# Altium schematic sheet [10]-EMMC Chip.SchDoc: RK3399 SOM Board Design V1.0
size A4; Author: AVIRAL MISHRA; DocumentNumber: 11; SheetNumber: 11; SheetTotal: 12; PROJECT CODE: A_V1.0
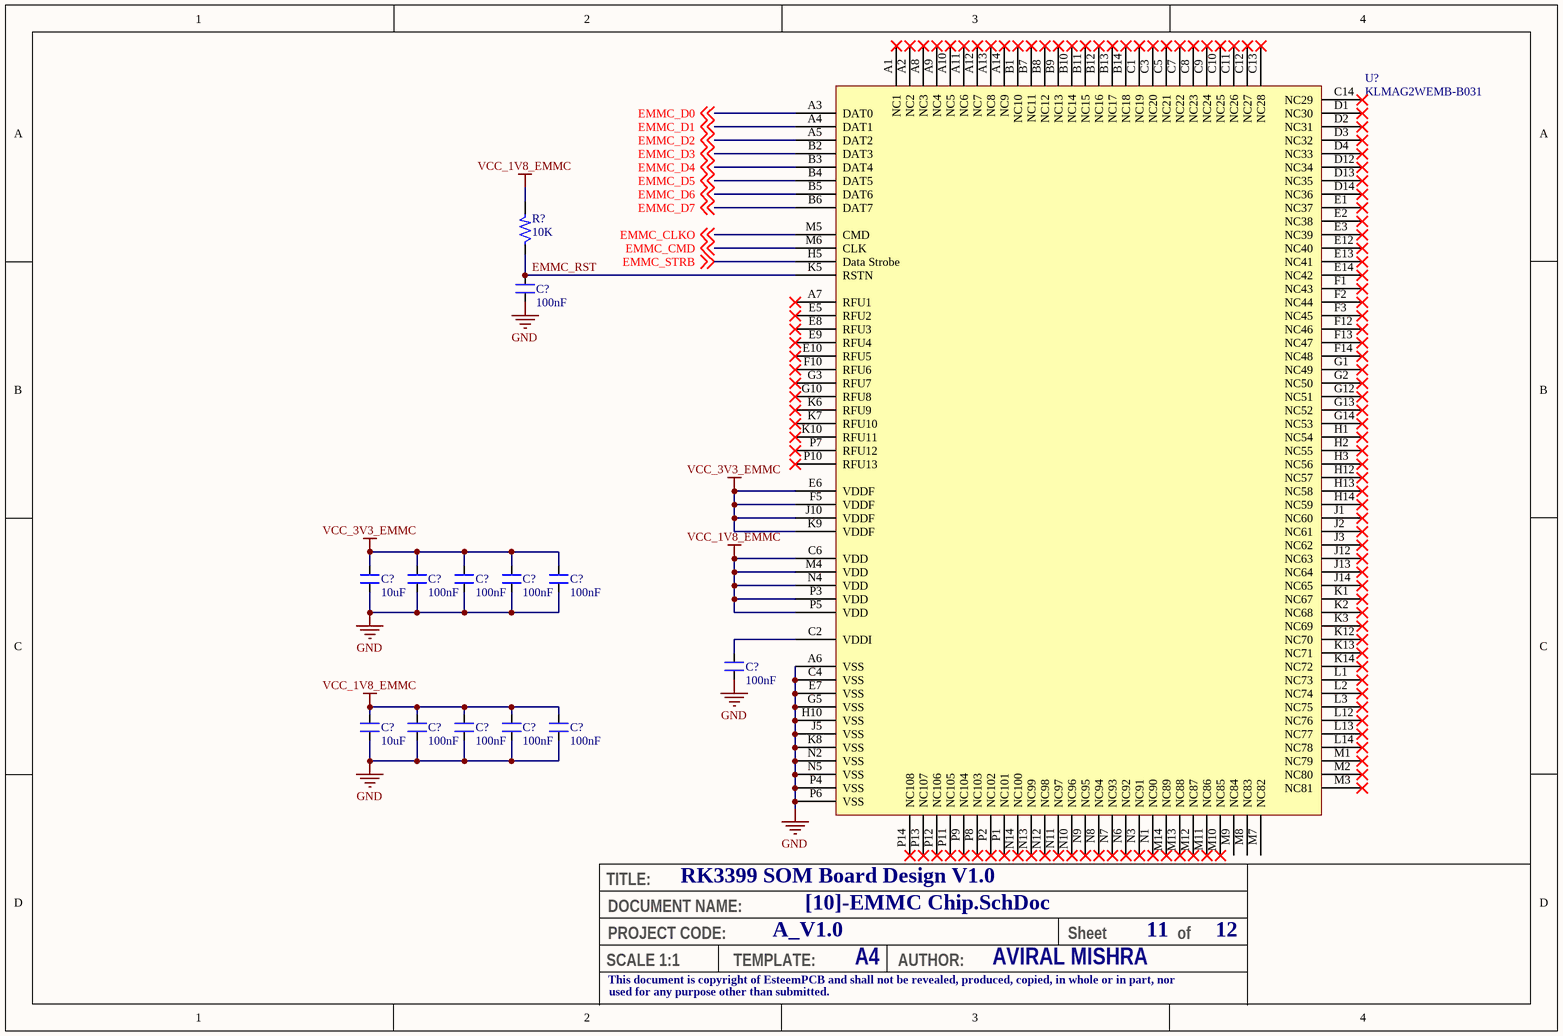
[diagram p0: [10]-EMMC Chip.SchDoc]

## Parts
(Parts that share a designator on the sheet are numbered #1, #2 ... from top to bottom, then left to right.)
C?#1  100nF  [CAP_0201]
C?#2  10uF  [CAP_0603]
C?#3  100nF  [CAP_0201]
C?#4  100nF  [CAP_0201]
C?#5  100nF  [CAP_0201]
C?#6  100nF  [CAP_0201]
C?#7  100nF  [CAP_0201]
C?#8  10uF  [CAP_0603]
C?#9  100nF  [CAP_0201]
C?#10  100nF  [CAP_0201]
C?#11  100nF  [CAP_0201]
C?#12  100nF  [CAP_0201]
R?  10K  [RES_0201]
U?  KLMAG2WEMB-B031  [BGA153C50P14X14_1150X1300X70]

## Nets
GND: C?#1.1 C?#2.1 C?#3.1 C?#4.1 C?#5.1 C?#6.1 C?#7.1 C?#8.1 C?#9.1 C?#10.1 C?#11.1 C?#12.1 U?.A6(VSS) U?.C4(VSS) U?.E7(VSS) U?.G5(VSS) U?.H10(VSS) U?.J5(VSS) U?.K8(VSS) U?.N2(VSS) U?.N5(VSS) U?.P4(VSS) U?.P6(VSS)
VCC_1V8_EMMC: C?#8.2 C?#9.2 C?#10.2 C?#11.2 C?#12.2 R?.2 U?.C6(VDD) U?.M4(VDD) U?.N4(VDD) U?.P3(VDD) U?.P5(VDD)
VCC_3V3_EMMC: C?#2.2 C?#3.2 C?#4.2 C?#5.2 C?#6.2 U?.E6(VDDF) U?.F5(VDDF) U?.J10(VDDF) U?.K9(VDDF)
EMMC_CLKO: U?.M5(CMD) ; off-sheet EMMC_CLKO
EMMC_CMD: U?.M6(CLK) ; off-sheet EMMC_CMD
EMMC_D0: U?.A3(DAT0) ; off-sheet EMMC_D0
EMMC_D1: U?.A4(DAT1) ; off-sheet EMMC_D1
EMMC_D2: U?.A5(DAT2) ; off-sheet EMMC_D2
EMMC_D3: U?.B2(DAT3) ; off-sheet EMMC_D3
EMMC_D4: U?.B3(DAT4) ; off-sheet EMMC_D4
EMMC_D5: U?.B4(DAT5) ; off-sheet EMMC_D5
EMMC_D6: U?.B5(DAT6) ; off-sheet EMMC_D6
EMMC_D7: U?.B6(DAT7) ; off-sheet EMMC_D7
EMMC_RST: C?#1.2 R?.1 U?.K5(RSTN)
EMMC_STRB: U?.H5(Data_Strobe) ; off-sheet EMMC_STRB
NetC?#7_2: C?#7.2 U?.C2(VDDI)

Not connected (* = marked no-connect by the designer): U? A1(NC1)* A2(NC2)* A7(RFU1)* A8(NC3)* A9(NC4)* A10(NC5)* A11(NC6)* A12(NC7)* A13(NC8)* A14(NC9)* B1(NC10)* B7(NC11)* B8(NC12)* B9(NC13)* B10(NC14)* B11(NC15)* B12(NC16)* B13(NC17)* B14(NC18)* C1(NC19)* C3(NC20)* C5(NC21)* C7(NC22)* C8(NC23)* C9(NC24)* C10(NC25)* C11(NC26)* C12(NC27)* C13(NC28)* C14(NC29)* D1(NC30)* D2(NC31)* D3(NC32)* D4(NC33)* D12(NC34)* D13(NC35)* D14(NC36)* E1(NC37)* E2(NC38)* E3(NC39)* E5(RFU2)* E8(RFU3)* E9(RFU4)* E10(RFU5)* E12(NC40)* E13(NC41)* E14(NC42)* F1(NC43)* F2(NC44)* F3(NC45)* F10(RFU6)* F12(NC46)* F13(NC47)* F14(NC48)* G1(NC49)* G2(NC50)* G3(RFU7)* G10(RFU8)* G12(NC51)* G13(NC52)* G14(NC53)* H1(NC54)* H2(NC55)* H3(NC56)* H12(NC57)* H13(NC58)* H14(NC59)* J1(NC60)* J2(NC61)* J3(NC62)* J12(NC63)* J13(NC64)* J14(NC65)* K1(NC67)* K2(NC68)* K3(NC69)* K6(RFU9)* K7(RFU10)* K10(RFU11)* K12(NC70)* K13(NC71)* K14(NC72)* L1(NC73)* L2(NC74)* L3(NC75)* L12(NC76)* L13(NC77)* L14(NC78)* M1(NC79)* M2(NC80)* M3(NC81)* M7(NC82) M8(NC83) M9(NC84) M10(NC85)* M11(NC86)* M12(NC87)* M13(NC88)* M14(NC89)* N1(NC90)* N3(NC91)* N6(NC92)* N7(NC93)* N8(NC94)* N9(NC95)* N10(NC96)* N11(NC97)* N12(NC98)* N13(NC99)* N14(NC100)* P1(NC101)* P2(NC102)* P7(RFU12)* P8(NC103)* P9(NC104)* P10(RFU13)* P11(NC105)* P12(NC106)* P13(NC107)* P14(NC108)*

## Notes on the sheet
- TITLE:
- DOCUMENT NAME:
- SCALE 1:1
- This document is copyright of EsteemPCB and shall not be revealed, produced, copied, in whole or in part, nor
- PROJECT CODE:
- TEMPLATE:
- A4
- AUTHOR:
- Sheet
- of
- used for any purpose other than submitted.

## Library data of the parts
C?#1 C?#3-C?#7 C?#9-C?#12 = CAP_100nF-25V-10%-0201: 0.1µF ±10% 25V Ceramic Capacitor X5R 0201 (0603 Metric) /; Manufacturer: TDK Corporation; Manufacturer Part Number: C0603X5R1E104K030BB; Case/Package: 0201; Supplier-1: Digikey
C?#2 C?#8 = CAP_10uF-10V-10%-0603: 10µF ±10% 10V Ceramic Capacitor X5R 0603 (1608 Metric) /; Manufacturer Part Number: GRM188R61A106KE69J; Manufacturer: Murata Electronics; Case/Package: 0603; Supplier-1: Digikey
R? = RES_10K-0.05W-1%-0201: 10 kOhms ±1% 0.05W, 1/20W Chip Resistor 0201 (0603 Metric) Thick Film /; Manufacturer: Stackpole Electronics Inc; Manufacturer Part Number: RMCF0201FT10K0; Case/Package: 0201; Supplier-1: Digikey
U? = IC_KLMAG2WEMB-B031: 16GB NAND Flash Memory; Manufacturer: Samsung Electronics; Manufacturer Part Number: KLMAG2WEMB-B031; Case/Package: 153-FBGA; Supplier-1: NA